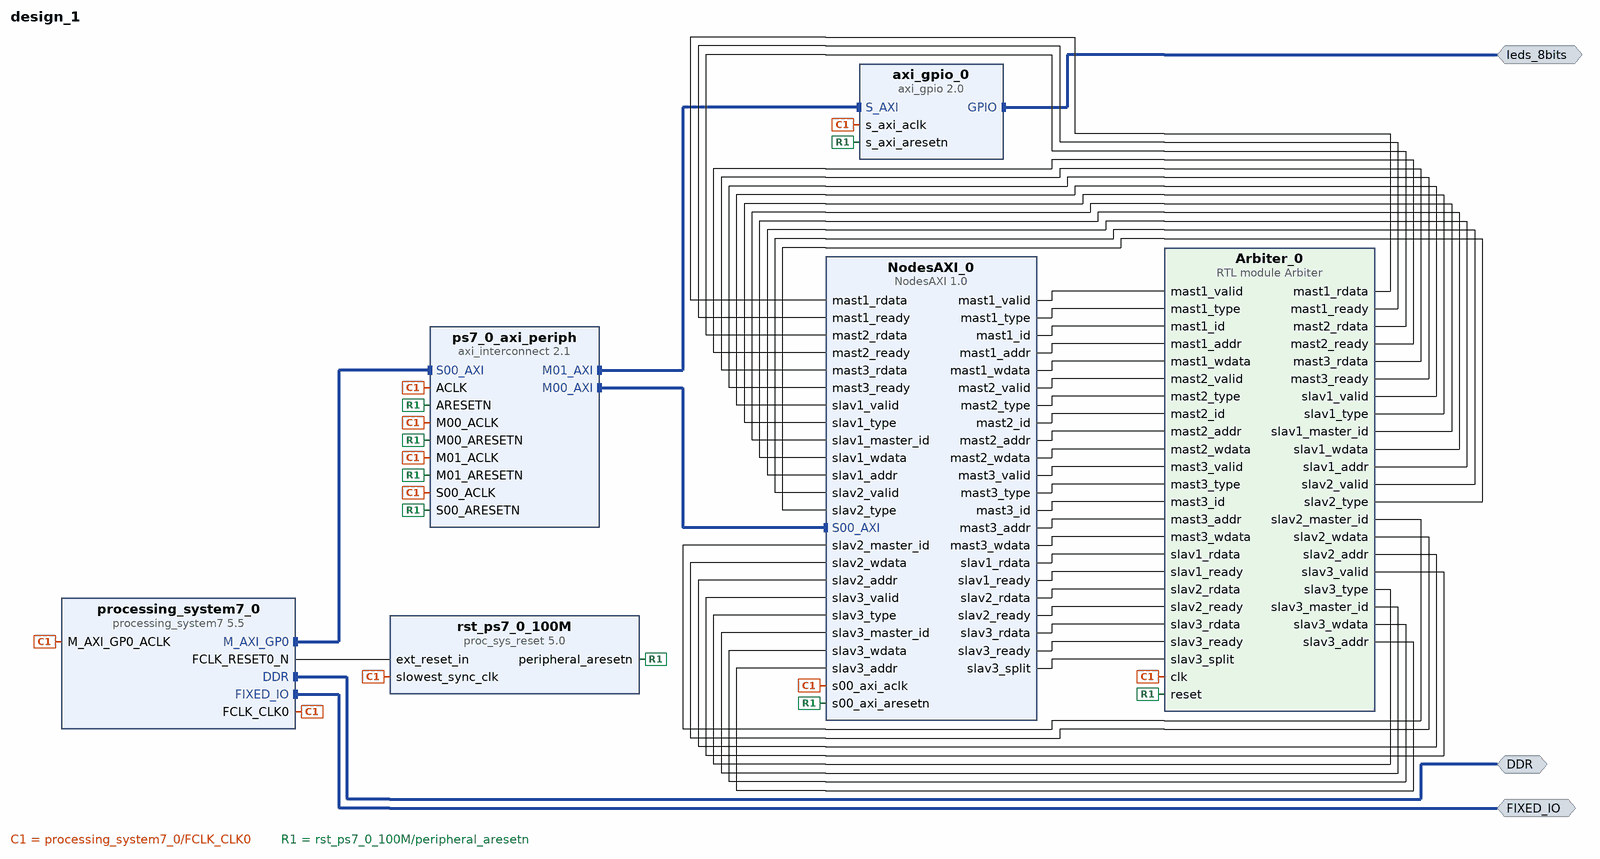
[diagram p0: block diagram of the top level]
# Vivado block design design_1, xc7z020clg484-1, Vivado 2019.2
create_bd_design design_1

create_bd_intf_port -mode Master -vlnv xilinx.com:interface:ddrx_rtl:1.0 DDR
create_bd_intf_port -mode Master -vlnv xilinx.com:display_processing_system7:fixedio_rtl:1.0 FIXED_IO
create_bd_intf_port -mode Master -vlnv xilinx.com:interface:gpio_rtl:1.0 leds_8bits

create_bd_cell -type ip -vlnv xilinx.com:ip:processing_system7:5.5 processing_system7_0
set_property -dict [list \
  CONFIG.PCW_APU_PERIPHERAL_FREQMHZ 666.666667 \
  CONFIG.PCW_ENET0_PERIPHERAL_ENABLE 0 \
  CONFIG.PCW_FPGA0_PERIPHERAL_FREQMHZ 100.000000 \
  CONFIG.PCW_FPGA1_PERIPHERAL_FREQMHZ 150.000000 \
  CONFIG.PCW_GPIO_MIO_GPIO_ENABLE 1 \
  CONFIG.PCW_GPIO_MIO_GPIO_IO MIO \
  CONFIG.PCW_I2C_RESET_ENABLE 1 \
  CONFIG.PCW_PRESET_BANK1_VOLTAGE {LVCMOS 1.8V} \
  CONFIG.PCW_QSPI_PERIPHERAL_ENABLE 0 \
  CONFIG.PCW_SD0_PERIPHERAL_ENABLE 0 \
  CONFIG.PCW_UART1_PERIPHERAL_ENABLE 1 \
  CONFIG.PCW_UART1_UART1_IO {MIO 48 .. 49} \
  CONFIG.PCW_UART_PERIPHERAL_FREQMHZ 50 \
  CONFIG.PCW_UIPARAM_DDR_FREQ_MHZ 533.333313 \
  CONFIG.PCW_UIPARAM_DDR_PARTNO {MT41J128M16 HA-15E} \
  CONFIG.PCW_USB0_PERIPHERAL_ENABLE 0 \
  CONFIG.PCW_USB_RESET_ENABLE 1 \
  CONFIG.preset ZedBoard \
] [get_bd_cells processing_system7_0]
# 219 more settings of processing_system7_0 are not shown: defaults, MIO pin electricals, DDR timing, and values the tool derives
create_bd_cell -type module -reference Arbiter Arbiter_0
create_bd_cell -type ip -vlnv xilinx.com:ip:proc_sys_reset:5.0 rst_ps7_0_100M
create_bd_cell -type ip -vlnv xilinx.com:ip:axi_interconnect:2.1 ps7_0_axi_periph
set_property -dict {CONFIG.NUM_MI 2} [get_bd_cells ps7_0_axi_periph]
create_bd_cell -type ip -vlnv xilinx.com:ip:axi_gpio:2.0 axi_gpio_0
set_property -dict {CONFIG.GPIO_BOARD_INTERFACE leds_8bits CONFIG.USE_BOARD_FLOW true} [get_bd_cells axi_gpio_0]
create_bd_cell -type ip -vlnv xilinx.com:user:NodesAXI:1.0 NodesAXI_0

# ---- connections ----

connect_bd_intf_net [get_bd_intf_pins ps7_0_axi_periph/M01_AXI] [get_bd_intf_pins axi_gpio_0/S_AXI]
connect_bd_intf_net [get_bd_intf_pins ps7_0_axi_periph/M00_AXI] [get_bd_intf_pins NodesAXI_0/S00_AXI]
connect_bd_intf_net [get_bd_intf_ports DDR] [get_bd_intf_pins processing_system7_0/DDR]
connect_bd_intf_net [get_bd_intf_ports FIXED_IO] [get_bd_intf_pins processing_system7_0/FIXED_IO]
connect_bd_intf_net [get_bd_intf_ports leds_8bits] [get_bd_intf_pins axi_gpio_0/GPIO]
connect_bd_intf_net [get_bd_intf_pins processing_system7_0/M_AXI_GP0] [get_bd_intf_pins ps7_0_axi_periph/S00_AXI]
connect_bd_net [get_bd_pins processing_system7_0/FCLK_CLK0] \
  [get_bd_pins processing_system7_0/M_AXI_GP0_ACLK] [get_bd_pins Arbiter_0/clk] [get_bd_pins rst_ps7_0_100M/slowest_sync_clk] \
  [get_bd_pins ps7_0_axi_periph/S00_ACLK] [get_bd_pins ps7_0_axi_periph/M00_ACLK] [get_bd_pins ps7_0_axi_periph/ACLK] \
  [get_bd_pins axi_gpio_0/s_axi_aclk] [get_bd_pins ps7_0_axi_periph/M01_ACLK] [get_bd_pins NodesAXI_0/s00_axi_aclk]
connect_bd_net [get_bd_pins processing_system7_0/FCLK_RESET0_N] [get_bd_pins rst_ps7_0_100M/ext_reset_in]
connect_bd_net [get_bd_pins rst_ps7_0_100M/peripheral_aresetn] \
  [get_bd_pins Arbiter_0/reset] [get_bd_pins ps7_0_axi_periph/S00_ARESETN] [get_bd_pins ps7_0_axi_periph/M00_ARESETN] \
  [get_bd_pins ps7_0_axi_periph/ARESETN] [get_bd_pins axi_gpio_0/s_axi_aresetn] [get_bd_pins ps7_0_axi_periph/M01_ARESETN] \
  [get_bd_pins NodesAXI_0/s00_axi_aresetn]
connect_bd_net [get_bd_pins NodesAXI_0/mast1_valid] [get_bd_pins Arbiter_0/mast1_valid]
connect_bd_net [get_bd_pins NodesAXI_0/mast1_type] [get_bd_pins Arbiter_0/mast1_type]
connect_bd_net [get_bd_pins NodesAXI_0/mast1_id] [get_bd_pins Arbiter_0/mast1_id]
connect_bd_net [get_bd_pins NodesAXI_0/mast1_addr] [get_bd_pins Arbiter_0/mast1_addr]
connect_bd_net [get_bd_pins NodesAXI_0/mast1_wdata] [get_bd_pins Arbiter_0/mast1_wdata]
connect_bd_net [get_bd_pins NodesAXI_0/mast2_valid] [get_bd_pins Arbiter_0/mast2_valid]
connect_bd_net [get_bd_pins NodesAXI_0/mast2_type] [get_bd_pins Arbiter_0/mast2_type]
connect_bd_net [get_bd_pins NodesAXI_0/mast2_id] [get_bd_pins Arbiter_0/mast2_id]
connect_bd_net [get_bd_pins NodesAXI_0/mast2_addr] [get_bd_pins Arbiter_0/mast2_addr]
connect_bd_net [get_bd_pins NodesAXI_0/mast2_wdata] [get_bd_pins Arbiter_0/mast2_wdata]
connect_bd_net [get_bd_pins NodesAXI_0/mast3_valid] [get_bd_pins Arbiter_0/mast3_valid]
connect_bd_net [get_bd_pins NodesAXI_0/mast3_type] [get_bd_pins Arbiter_0/mast3_type]
connect_bd_net [get_bd_pins NodesAXI_0/mast3_id] [get_bd_pins Arbiter_0/mast3_id]
connect_bd_net [get_bd_pins NodesAXI_0/mast3_addr] [get_bd_pins Arbiter_0/mast3_addr]
connect_bd_net [get_bd_pins NodesAXI_0/mast3_wdata] [get_bd_pins Arbiter_0/mast3_wdata]
connect_bd_net [get_bd_pins NodesAXI_0/slav1_rdata] [get_bd_pins Arbiter_0/slav1_rdata]
connect_bd_net [get_bd_pins NodesAXI_0/slav1_ready] [get_bd_pins Arbiter_0/slav1_ready]
connect_bd_net [get_bd_pins NodesAXI_0/slav2_rdata] [get_bd_pins Arbiter_0/slav2_rdata]
connect_bd_net [get_bd_pins NodesAXI_0/slav2_ready] [get_bd_pins Arbiter_0/slav2_ready]
connect_bd_net [get_bd_pins NodesAXI_0/slav3_rdata] [get_bd_pins Arbiter_0/slav3_rdata]
connect_bd_net [get_bd_pins NodesAXI_0/slav3_ready] [get_bd_pins Arbiter_0/slav3_ready]
connect_bd_net [get_bd_pins NodesAXI_0/slav3_split] [get_bd_pins Arbiter_0/slav3_split]
connect_bd_net [get_bd_pins Arbiter_0/mast1_rdata] [get_bd_pins NodesAXI_0/mast1_rdata]
connect_bd_net [get_bd_pins Arbiter_0/mast1_ready] [get_bd_pins NodesAXI_0/mast1_ready]
connect_bd_net [get_bd_pins Arbiter_0/mast2_rdata] [get_bd_pins NodesAXI_0/mast2_rdata]
connect_bd_net [get_bd_pins Arbiter_0/mast2_ready] [get_bd_pins NodesAXI_0/mast2_ready]
connect_bd_net [get_bd_pins Arbiter_0/mast3_rdata] [get_bd_pins NodesAXI_0/mast3_rdata]
connect_bd_net [get_bd_pins Arbiter_0/mast3_ready] [get_bd_pins NodesAXI_0/mast3_ready]
connect_bd_net [get_bd_pins Arbiter_0/slav1_valid] [get_bd_pins NodesAXI_0/slav1_valid]
connect_bd_net [get_bd_pins Arbiter_0/slav1_type] [get_bd_pins NodesAXI_0/slav1_type]
connect_bd_net [get_bd_pins Arbiter_0/slav1_master_id] [get_bd_pins NodesAXI_0/slav1_master_id]
connect_bd_net [get_bd_pins Arbiter_0/slav1_wdata] [get_bd_pins NodesAXI_0/slav1_wdata]
connect_bd_net [get_bd_pins Arbiter_0/slav1_addr] [get_bd_pins NodesAXI_0/slav1_addr]
connect_bd_net [get_bd_pins Arbiter_0/slav2_valid] [get_bd_pins NodesAXI_0/slav2_valid]
connect_bd_net [get_bd_pins Arbiter_0/slav2_type] [get_bd_pins NodesAXI_0/slav2_type]
connect_bd_net [get_bd_pins Arbiter_0/slav2_master_id] [get_bd_pins NodesAXI_0/slav2_master_id]
connect_bd_net [get_bd_pins Arbiter_0/slav2_wdata] [get_bd_pins NodesAXI_0/slav2_wdata]
connect_bd_net [get_bd_pins Arbiter_0/slav2_addr] [get_bd_pins NodesAXI_0/slav2_addr]
connect_bd_net [get_bd_pins Arbiter_0/slav3_valid] [get_bd_pins NodesAXI_0/slav3_valid]
connect_bd_net [get_bd_pins Arbiter_0/slav3_type] [get_bd_pins NodesAXI_0/slav3_type]
connect_bd_net [get_bd_pins Arbiter_0/slav3_master_id] [get_bd_pins NodesAXI_0/slav3_master_id]
connect_bd_net [get_bd_pins Arbiter_0/slav3_wdata] [get_bd_pins NodesAXI_0/slav3_wdata]
connect_bd_net [get_bd_pins Arbiter_0/slav3_addr] [get_bd_pins NodesAXI_0/slav3_addr]

# ---- address map ----
assign_bd_address -offset 0x41200000 -range 64K -target_address_space [get_bd_addr_spaces processing_system7_0/Data] [get_bd_addr_segs axi_gpio_0/S_AXI/Reg]
assign_bd_address -offset 0x43C00000 -range 64K -target_address_space [get_bd_addr_spaces processing_system7_0/Data] [get_bd_addr_segs NodesAXI_0/S00_AXI/S00_AXI_reg]

validate_bd_design
save_bd_design
